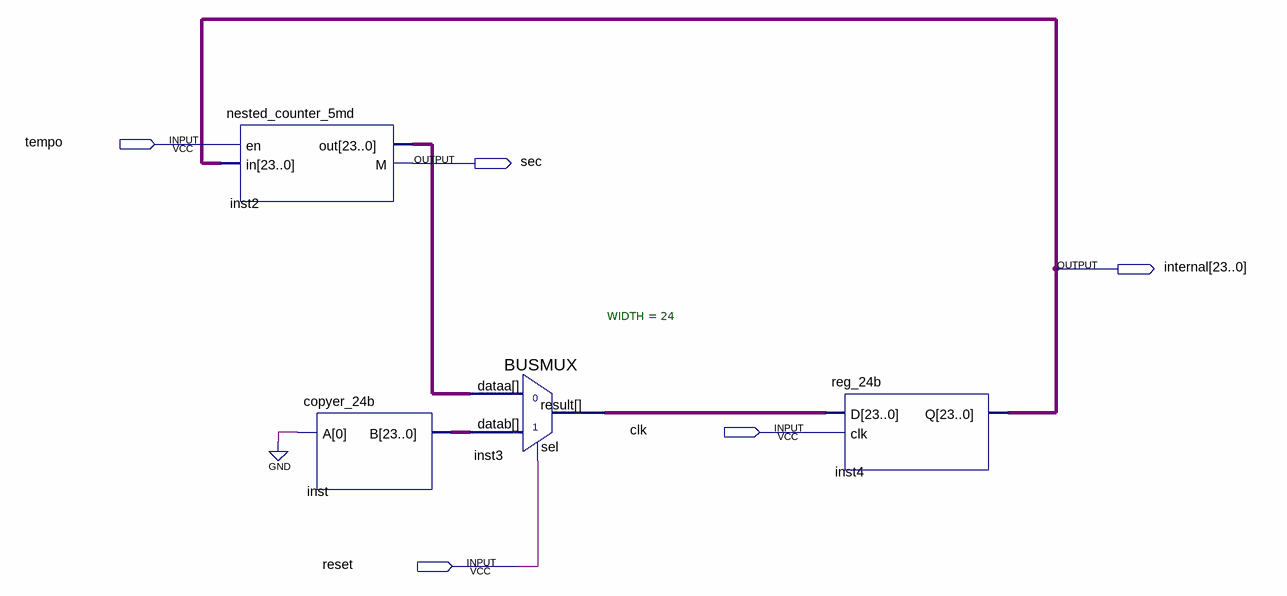
[diagram p0: schematic sheet]
// Quartus schematic nested_counter_10hz.bdf as structural Verilog: 4 symbols, 5 pins
module nested_counter_10hz (
  input  tempo,
  input  clk,
  input  reset,
  output sec,
  output [23:0] internal
);

  wire [23:0] inst2_out, inst3_result, inst_b;

  nested_counter_5md inst2 (.en(tempo), .in(internal), .out(inst2_out), .M(sec));
  copyer_24b inst (.A(1'b0), .B(inst_b));
  BUSMUX #(.WIDTH(24)) inst3 (.datab(inst_b), .sel(reset), .dataa(inst2_out), .result(inst3_result));
  reg_24b inst4 (.D(inst3_result), .clk(clk), .Q(internal));
endmodule
